# EAGLE design 3HP_Multi (EAGLE 7.1.0)
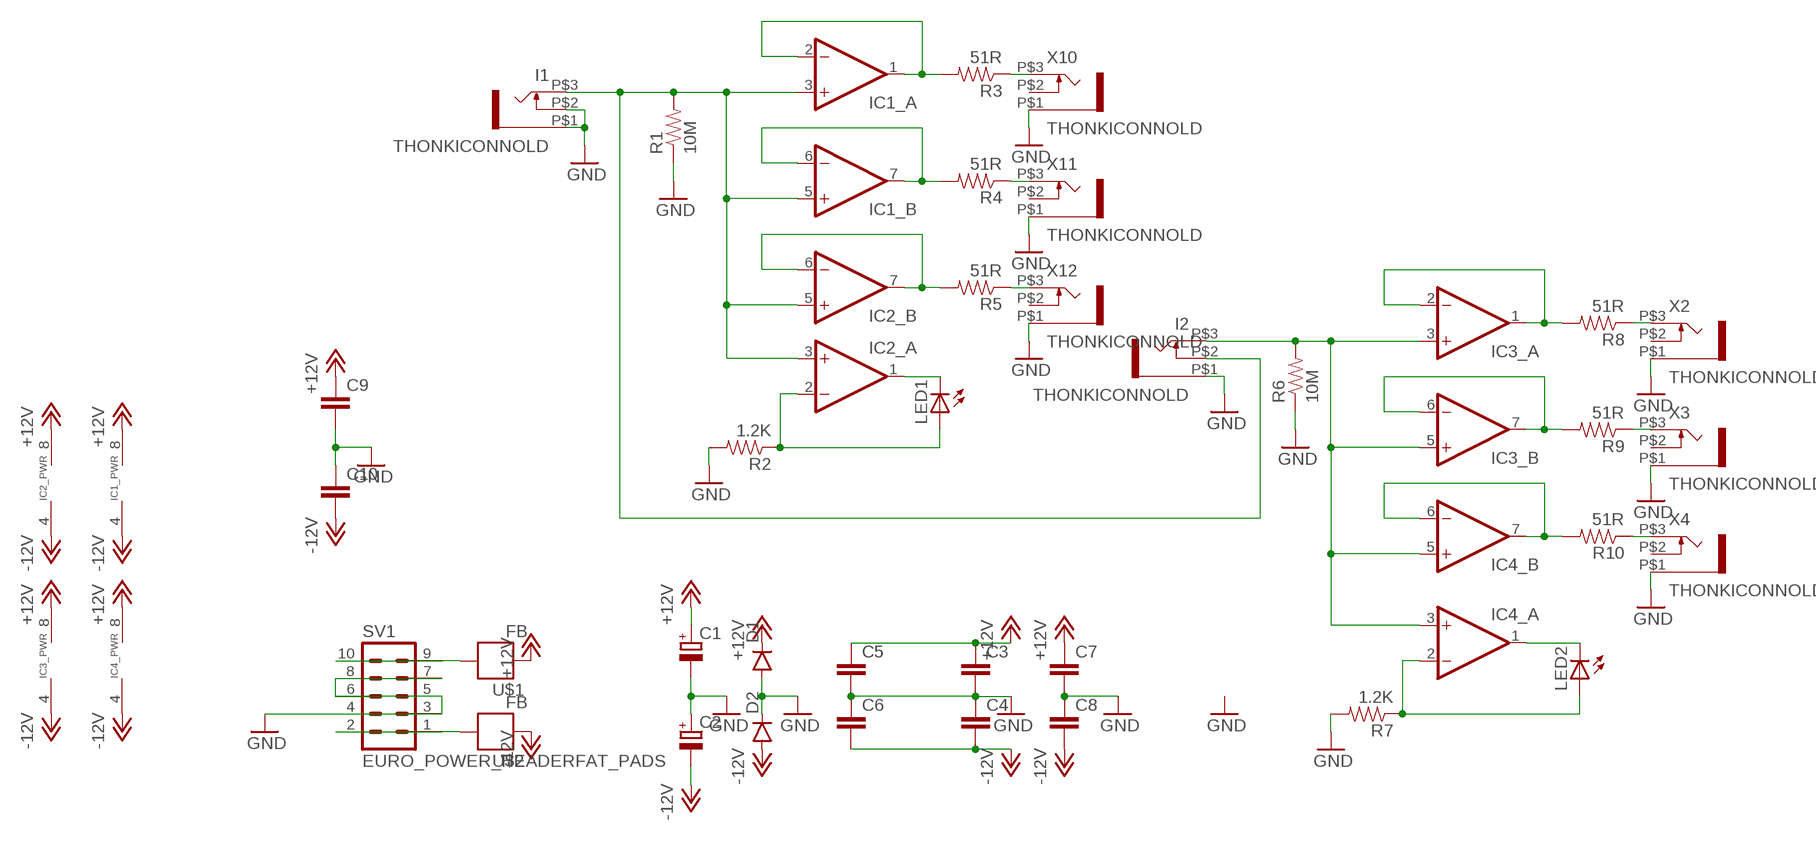
[diagram p0: schematic, sheet 1]

## Parts
C1  CAPACITOR_POL-CASE_B  [CASE_B]
C2  CAPACITOR_POL-CASE_B  [CASE_B]
C3  CAP0603-CAP  [0603-CAP]
C4  CAP0603-CAP  [0603-CAP]
C5  CAP0603-CAP  [0603-CAP]
C6  CAP0603-CAP  [0603-CAP]
C7  CAP0603-CAP  [0603-CAP]
C8  CAP0603-CAP  [0603-CAP]
C9  CAP0603-CAP  [0603-CAP]
C10  CAP0603-CAP  [0603-CAP]
D1  DIODESOD123  [SOD-123]
D2  DIODESOD123  [SOD-123]
I1  THONKICONNOLD  [THONKICONN]
I2  THONKICONNOLD  [THONKICONN]
IC1  DUALSMD  [SO08]
IC2  DUALSMD  [SO08]
IC3  DUALSMD  [SO08]
IC4  DUALSMD  [SO08]
LED1  LED3MM  [LED3MM]
LED2  LED3MM  [LED3MM]
R1  10M  RESISTOR0603  [0603-RES]
R2  1.2K  RESISTOR0603  [0603-RES]
R3  51R  RESISTOR0603  [0603-RES]
R4  51R  RESISTOR0603  [0603-RES]
R5  51R  RESISTOR0603  [0603-RES]
R6  10M  RESISTOR0603  [0603-RES]
R7  1.2K  RESISTOR0603  [0603-RES]
R8  51R  RESISTOR0603  [0603-RES]
R9  51R  RESISTOR0603  [0603-RES]
R10  51R  RESISTOR0603  [0603-RES]
SV1  EURO_POWER_HEADERFAT_PADS  [EURO_PWR_HEADER_FAT]
U$1  FB  [0603]
U$2  FB  [0603]
X2  THONKICONNOLD  [THONKICONN]
X3  THONKICONNOLD  [THONKICONN]
X4  THONKICONNOLD  [THONKICONN]
X10  THONKICONNOLD  [THONKICONN]
X11  THONKICONNOLD  [THONKICONN]
X12  THONKICONNOLD  [THONKICONN]

## Nets
+12V: C1.+ C3.1 C5.1 C7.1 C9.1 D1.C IC1.8(_PWR:V+) IC2.8(_PWR:V+) IC3.8(_PWR:V+) IC4.8(_PWR:V+) U$1.2
-12V: C2.- C4.2 C6.2 C8.2 C10.2 D2.A IC1.4(_PWR:V-) IC2.4(_PWR:V-) IC3.4(_PWR:V-) IC4.4(_PWR:V-) U$2.2
GND: C1.- C2.+ C3.2 C4.1 C5.2 C6.1 C7.2 C8.1 C9.2 C10.1 D1.A D2.C I1.P$1 I1.P$2 I2.P$1 R1.1 R2.2 R6.1 R7.2 SV1.3 SV1.4 SV1.5 SV1.6 SV1.7 SV1.8 X2.P$1 X3.P$1 X4.P$1 X10.P$1 X11.P$1 X12.P$1
N$1: IC4.1(_A:OUT) LED2.K(C)
N$2: IC1.6(_B:-IN) IC1.7(_B:OUT) R4.2
N$3: IC1.1(_A:OUT) IC1.2(_A:-IN) R3.2
N$4: IC2.1(_A:OUT) LED1.K(C)
N$5: IC2.6(_B:-IN) IC2.7(_B:OUT) R5.2
N$6: R5.1 X12.P$3
N$7: R4.1 X11.P$3
N$8: R3.1 X10.P$3
N$9: SV1.9 SV1.10 U$1.1
N$10: R8.1 X2.P$3
N$11: IC3.1(_A:OUT) IC3.2(_A:-IN) R8.2
N$12: R9.1 X3.P$3
N$13: IC2.2(_A:-IN) LED1.A R2.1
N$14: I1.P$3 I2.P$2 IC1.3(_A:+IN) IC1.5(_B:+IN) IC2.3(_A:+IN) IC2.5(_B:+IN) R1.2
N$15: IC3.6(_B:-IN) IC3.7(_B:OUT) R9.2
N$16: R10.1 X4.P$3
N$17: IC4.6(_B:-IN) IC4.7(_B:OUT) R10.2
N$18: IC4.2(_A:-IN) LED2.A R7.1
N$19: I2.P$3 IC3.3(_A:+IN) IC3.5(_B:+IN) IC4.3(_A:+IN) IC4.5(_B:+IN) R6.2
N$20: SV1.1 SV1.2 U$2.1
Unconnected: X2.P$2 X3.P$2 X4.P$2 X10.P$2 X11.P$2 X12.P$2

## Library data of the parts
C1 C2 = dp_devices:CAPACITOR_POL: Polarized capacitor in various packages
C3-C10 = SparkFun-Passives:CAP: Capacitor Standard 0603 ceramic capacitor, and 0.1" leaded capacitor.
D1 D2 = SparkFun-DiscreteSemi:DIODE: Diode These are standard reverse protection diodes and small signal diodes. SMA package can handle up to about 1A. SOD-323 can handle about 200mA. What the SOD-323 package when ordering, there are some mfgs out there that are 5-pin packages.
I1 I2 X2-X4 X10-X12 = MusicThingModular:THONKICONN: 3.5mm socket for Eurorack modular synths
IC1-IC4 = integrated circuits:DUAL: OP AMP
LED1 LED2 = led:LED: LED OSRAM: - CHIPLED LG R971, LG N971, LY N971, LG Q971, LY Q971, LO R971, LY R971 LH N974, LH R974 LS Q976, LO Q976, LY Q976 LO Q996 - Hyper CHIPLED LW Q18S LB Q993, LB Q99A, LB R99A - SideLED LS A670, LO A670, LY A670, LG A670, LP A670 LB A673, LV A673, LT A673, LW A673 LH A674 LY A675 LS A676, LA A676, LO A676, LY A676, LW A676 LS A679, LY A679, LG A679 - Hyper Micro SIDELED® LS Y876, LA Y876, LO Y876, LY Y876 LT Y87S - SmartLED LW L88C, LW L88S LB L89C, LB L89S, LG L890 LS L89K, LO L89K, LY L89K LS L896, LA L896, LO L896, LY L896 - TOPLED LS T670, LO T670, LY T670, LG T670, LP T670 LSG T670, LSP T670, LSY T670, LOP T670, LYG T670 LG T671, LOG T671, LSG T671 LB T673, LV T673, LT T673, LW T673 LH T674 LS T676, LA T676, LO T676, LY T676, LB T676, LH T676, LSB T676, LW T676 LB T67C, LV T67C, LT T67C, LS T67K, LO T67K, LY T67K, LW E67C LS E67B, LA E67B, LO E67B, LY E67B, LB E67C, LV E67C, LT E67C LW T67C LS T679, LY T679, LG T679 LS T770, LO T770, LY T770, LG T770, LP T770 LB T773, LV T773, LT T773, LW T773 LH T774 LS E675, LA E675, LY E675, LS T675 LS T776, LA T776, LO T776, LY T776, LB T776 LHGB T686 LT T68C, LB T68C - Hyper Mini TOPLED® LB M676 - Mini TOPLED Santana® LG M470 LS M47K, LO M47K, LY M47K Source: http://www.osram.convergy.de LUXEON: - LUMILED® LXK2-PW12-R00, LXK2-PW12-S00, LXK2-PW14-U00, LXK2-PW14-V00 LXK2-PM12-R00, LXK2-PM12-S00, LXK2-PM14-U00 LXK2-PE12-Q00, LXK2-PE12-R00, LXK2-PE12-S00, LXK2-PE14-T00, LXK2-PE14-U00 LXK2-PB12-K00, LXK2-PB12-L00, LXK2-PB12-M00, LXK2-PB14-N00, LXK2-PB14-P00, LXK2-PB14-Q00 LXK2-PR12-L00, LXK2-PR12-M00, LXK2-PR14-Q00, LXK2-PR14-R00 LXK2-PD12-Q00, LXK2-PD12-R00, LXK2-PD12-S00 LXK2-PH12-R00, LXK2-PH12-S00 LXK2-PL12-P00, LXK2-PL12-Q00, LXK2-PL12-R00 Source: www.luxeon.com KINGBRIGHT: KA-3528ASYC Source: www.kingbright.com
R1-R10 = SparkFun-Resistors:RESISTOR: Resistor Basic schematic elements and footprints for 0603, 1206, and PTH resistors.
SV1 = MusicThingModular:EURO_POWER_HEADER: Power Header 10 pin power header for Eurorack Power Supplies Variants with fatter pads for easier soldering, and the LOCK variant which has 5mil offset pins to hold the component in place before soldering
U$1 U$2 = SparkFun-Passives:FB

## Board
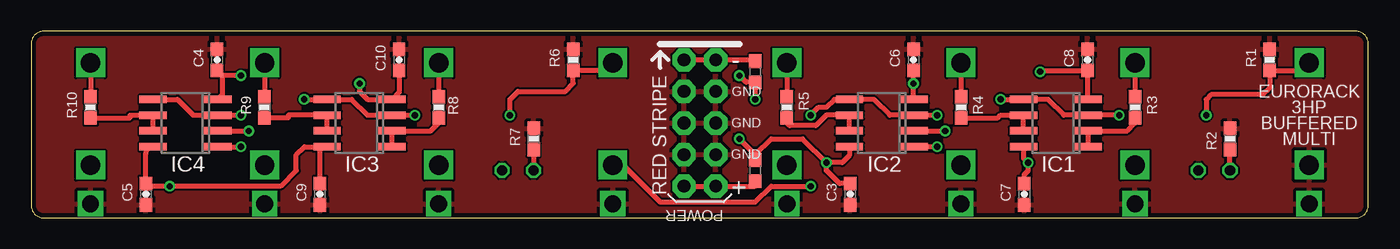
[diagram p1: board, top side]
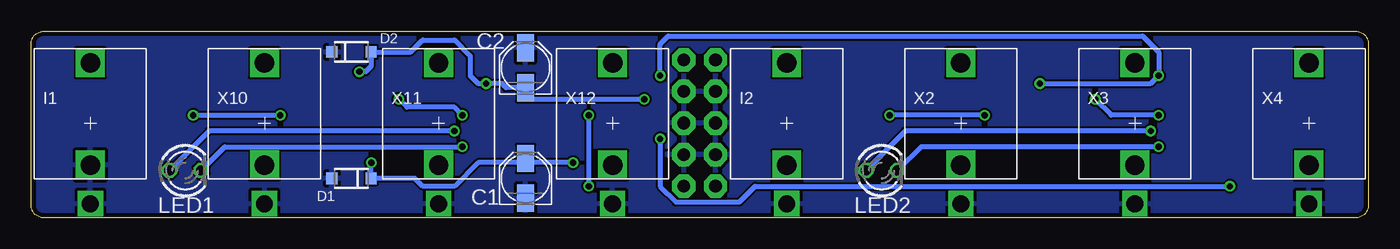
[diagram p2: board, bottom side, seen from below]

Size 107.3 x 15 mm. Coordinates in mm from the lower left corner, seen from the top.
Outline: 0,14 0,1 arc90 1,0 106.3,0 arc90 107.3,1 107.3,14 arc90 106.3,15 1,15 arc90 0,14
Copper layers (1*16): Top 0.0356mm / dielectric 1.5011mm / Bottom 0.0356mm
Design rules "LaenPCBOrder": minimum track width 6mil, minimum drill 13mil, track to track 6mil, track to pad 6mil, pad to pad 6mil, via to via 6mil, smd to smd 6mil, copper to edge 15mil, drill to drill 6mil, minimum pad ring 7mil, minimum via ring 7mil, stop-mask expansion 3mil, vias tented up to drill 0mil, thermal gap 10mil

### Footprints (pad centres in the part's own frame; a part is rotated, then mirrored left to right if it is on the bottom)
CASE_B = smd 2.2 x 1.4: + 1.6,0; - -1.6,0
0603-CAP = smd 1.1 x 1: 1 -0.85,0; 2 0.85,0
SOD-123 = smd 0.9 x 0.95: A 1.575,0; C -1.575,0
THONKICONN = drill 1.35 square: P$1 0,-6.48 | drill 1.55 square: P$2 0,-3.38; P$3 0,4.84
SO08 = smd 0.6 x 2.2: 1 -1.905,-2.6; 2 -0.635,-2.6; 3 0.635,-2.6; 4 1.905,-2.6; 5 1.905,2.6; 6 0.635,2.6; 7 -0.635,2.6; 8 -1.905,2.6
LED3MM = drill 0.813 octagon: A -1.27,0; K 1.27,0
0603-RES = smd 1.1 x 1: 1 -0.85,0; 2 0.85,0
EURO_PWR_HEADER_FAT = drill 1.016 pad 1.88 octagon: 1 -5.08,-1.27; 2 -5.08,1.27; 3 -2.54,-1.27; 4 -2.54,1.27; 5 0,-1.27; 6 0,1.27; 7 2.54,-1.27; 8 2.54,1.27; 9 5.08,-1.27; 10 5.08,1.27
0603 = smd 1.1 x 1: 1 -0.85,0; 2 0.85,0

### Placement (x,y rotation side)
C1  67.63,3.17 90 bottom
C2  67.63,12.06 90 bottom
C3  65.72,1.91 270 top
C4  14.92,12.7 270 top
C5  9.21,1.91 270 top
C6  70.8,12.7 270 top
C7  79.69,1.91 270 top
C8  84.77,12.7 270 top
C9  23.18,1.91 270 top
C10  29.53,12.7 270 top
D1  81.6,3.17 180 bottom
D2  81.6,13.34 0 bottom
I1  102.55,7.62 0 bottom
I2  46.67,7.62 0 bottom
IC1  82.23,7.62 90 top
IC2  68.26,7.62 90 top
IC3  26.35,7.62 90 top
IC4  12.38,7.62 90 top
LED1  94.93,3.81 0 bottom
LED2  39.05,3.81 0 bottom
R1  99.38,12.7 270 top
R2  96.2,6.35 90 top
R3  88.58,8.89 270 top
R4  74.61,8.89 270 top
R5  60.64,8.89 270 top
R6  43.5,12.7 270 top
R7  40.32,6.35 90 top
R8  32.7,8.89 270 top
R9  18.73,8.89 270 top
R10  4.76,8.89 270 top
SV1  53.66,7.62 270 top
U$1  58.1,3.81 90 top
U$2  58.1,11.75 270 top
X2  32.7,7.62 0 bottom
X3  18.73,7.62 0 bottom
X4  4.76,7.62 0 bottom
X10  88.58,7.62 0 bottom
X11  74.61,7.62 0 bottom
X12  60.64,7.62 0 bottom

### Tracks (layer width: path | path; a pad name or v marks a point on that pad's centre or on a via)
+12V  (via drill 0.5)
  Top 0.406: 58.1,5.08 59.37,6.35 61.91,6.35 v63.82,4.45 | C3.1 64.87,2.76 63.82,3.81 v63.82,4.45 | IC2.8 65.66,5.02 65.09,4.45 v63.82,4.45 | IC1.8 79.63,4.76 v80.01,4.45 80.01,3.81 79.69,3.49 C7.1 | U$1.2 58.1,5.08 | 58.1,5.08 v56.83,6.35 | IC4.8 arc90 9.21,5.14 C5.1 9.42,2.54 v11.11,2.54 20,2.54 21.27,3.81 21.27,5.08 21.91,5.71 23.18,5.71 | 23.18,5.71 IC3.8 | C9.1 23.18,5.71
  Bottom 0.406: v63.82,4.45 67.63,4.45 | 67.63,4.45 C1.+ | 67.63,4.45 71.44,4.45 73.34,2.54 75.88,2.54 76.52,3.17 D1.C 80.01,3.49 v80.01,4.45 | v56.83,6.35 56.83,2.54 55.56,1.27 50.48,1.27 49.21,2.54 v11.11,2.54
-12V  (via drill 0.5)
  Top 0.406: v58.1,9.53 U$2.2 57.36,10.9 v56.83,11.43 | C6.2 v70.8,10.79 70.8,9.53 IC2.4 | v80.96,11.75 80.96,11.85 C8.2 84.77,9.53 IC1.4 | v16.83,11.43 15.34,11.43 | 15.34,11.43 C4.2 | 15.34,11.43 15.34,9.88 IC4.4 | C10.2 29.53,10.1 IC3.4 26.99,9.53 26.35,10.16 v26.35,10.79
  Bottom 0.406: v58.1,9.53 67.63,9.53 C2.- 69.2,10.46 69.53,10.79 v70.8,10.79 71.44,10.79 72.07,11.43 72.07,13.02 73.34,14.29 75.88,14.29 76.83,13.34 D2.A 80.02,12.18 80.45,11.75 v80.96,11.75 | v56.83,11.43 56.83,13.97 56.2,14.61 18.1,14.61 16.83,13.34 v16.83,11.43 17.46,10.79 v26.35,10.79
GND
  pour Bottom: -1.59,17.78 111.44,17.78 111.44,-2.54 -1.59,-2.54
  pour Top: -5.4,17.78 110.17,17.78 110.17,-5.08 -5.4,-5.08
N$1  (via drill 0.5)
  Top 0.406: IC4.1 v16.83,5.71
  Bottom 0.406: v16.83,5.71 35.88,5.71 LED2.K
N$2
  Top 0.406: R4.2 77.57,8.04 77.79,8.26 IC1.6 IC1.7
N$3
  Top 0.406: IC1.1 IC1.2 87.95,6.99 88.58,7.62 R3.2
N$4  (via drill 0.5)
  Top 0.406: v72.71,5.71 IC2.1
  Bottom 0.406: LED1.K 91.76,5.71 v72.71,5.71
N$5
  Top 0.406: IC2.7 IC2.6 63.82,8.26 62.96,7.41 60.86,7.41 60.64,7.62 R5.2
N$6
  Top 0.406: X12.P$3 R5.1
N$7
  Top 0.406: X11.P$3 R4.1
N$8
  Top 0.406: X10.P$3 R3.1
N$9
  Top 0.406: SV1.9 SV1.10 58.1,2.54 U$1.1
N$10
  Top 0.406: X2.P$3 R8.1
N$11
  Top 0.406: R8.2 32.7,7.62 32.07,6.99 IC3.2 IC3.1
N$12
  Top 0.406: X3.P$3 R9.1
N$13  (via drill 0.5)
  Top 0.406: LED1.A 96.2,5.4 96.42,5.5 R2.1 | IC2.2 v73.34,6.99
  Bottom 0.406: v73.34,6.99 93.03,6.99 LED1.A
N$14  (via drill 0.5)
  Top 0.406: I1.P$3 102.55,11.85 R1.2 99.38,10.44 98.84,9.91 94.68,9.91 94.3,9.53 v94.3,8.26 | v87.31,8.26 IC1.3 82.87,8.26 81.6,9.53 IC1.5 v77.79,9.53 | v72.71,8.26 IC2.3 68.9,8.26 67.63,9.53 IC2.5 64.45,9.53 63.82,8.89 63.18,8.89 v62.55,8.26 | I2.P$2 47.51,4.24 50.48,1.27 58.1,1.27 59.37,2.54 v62.55,2.54
  Bottom 0.406: v94.3,8.26 v87.31,8.26 | v72.71,8.26 73.34,8.89 77.15,8.89 v77.79,9.53 | v62.55,2.54 v62.55,8.26
N$15
  Top 0.406: IC3.7 IC3.6 20.64,8.26 20.64,8.04 R9.2
N$16
  Top 0.406: X4.P$3 R10.1
N$17
  Top 0.406: IC4.7 IC4.6 7.94,8.26 7.94,8.04 R10.2
N$18  (via drill 0.5)
  Top 0.406: R7.1 40.22,5.5 40.32,5.08 LED2.A | IC4.2 v17.46,6.99
  Bottom 0.406: v17.46,6.99 37.15,6.99 LED2.A
N$19  (via drill 0.5)
  Top 0.406: I2.P$3 46.67,11.85 R6.2 43.5,10.79 42.86,10.16 39.05,10.16 38.42,9.53 v38.42,8.26 | v30.8,8.26 IC3.3 26.99,8.26 25.72,9.53 IC3.5 v21.91,9.53 | IC4.5 11.75,9.53 13.02,8.26 IC4.3 v16.83,8.26
  Bottom 0.406: v30.8,8.26 v38.42,8.26 | v16.83,8.26 20.64,8.26 v21.91,9.53
N$20
  Top 0.406: SV1.1 SV1.2 58.1,12.7 U$2.1

### Text on the board
tNames: EURORACK | 3HP | BUFFERED | MULTI